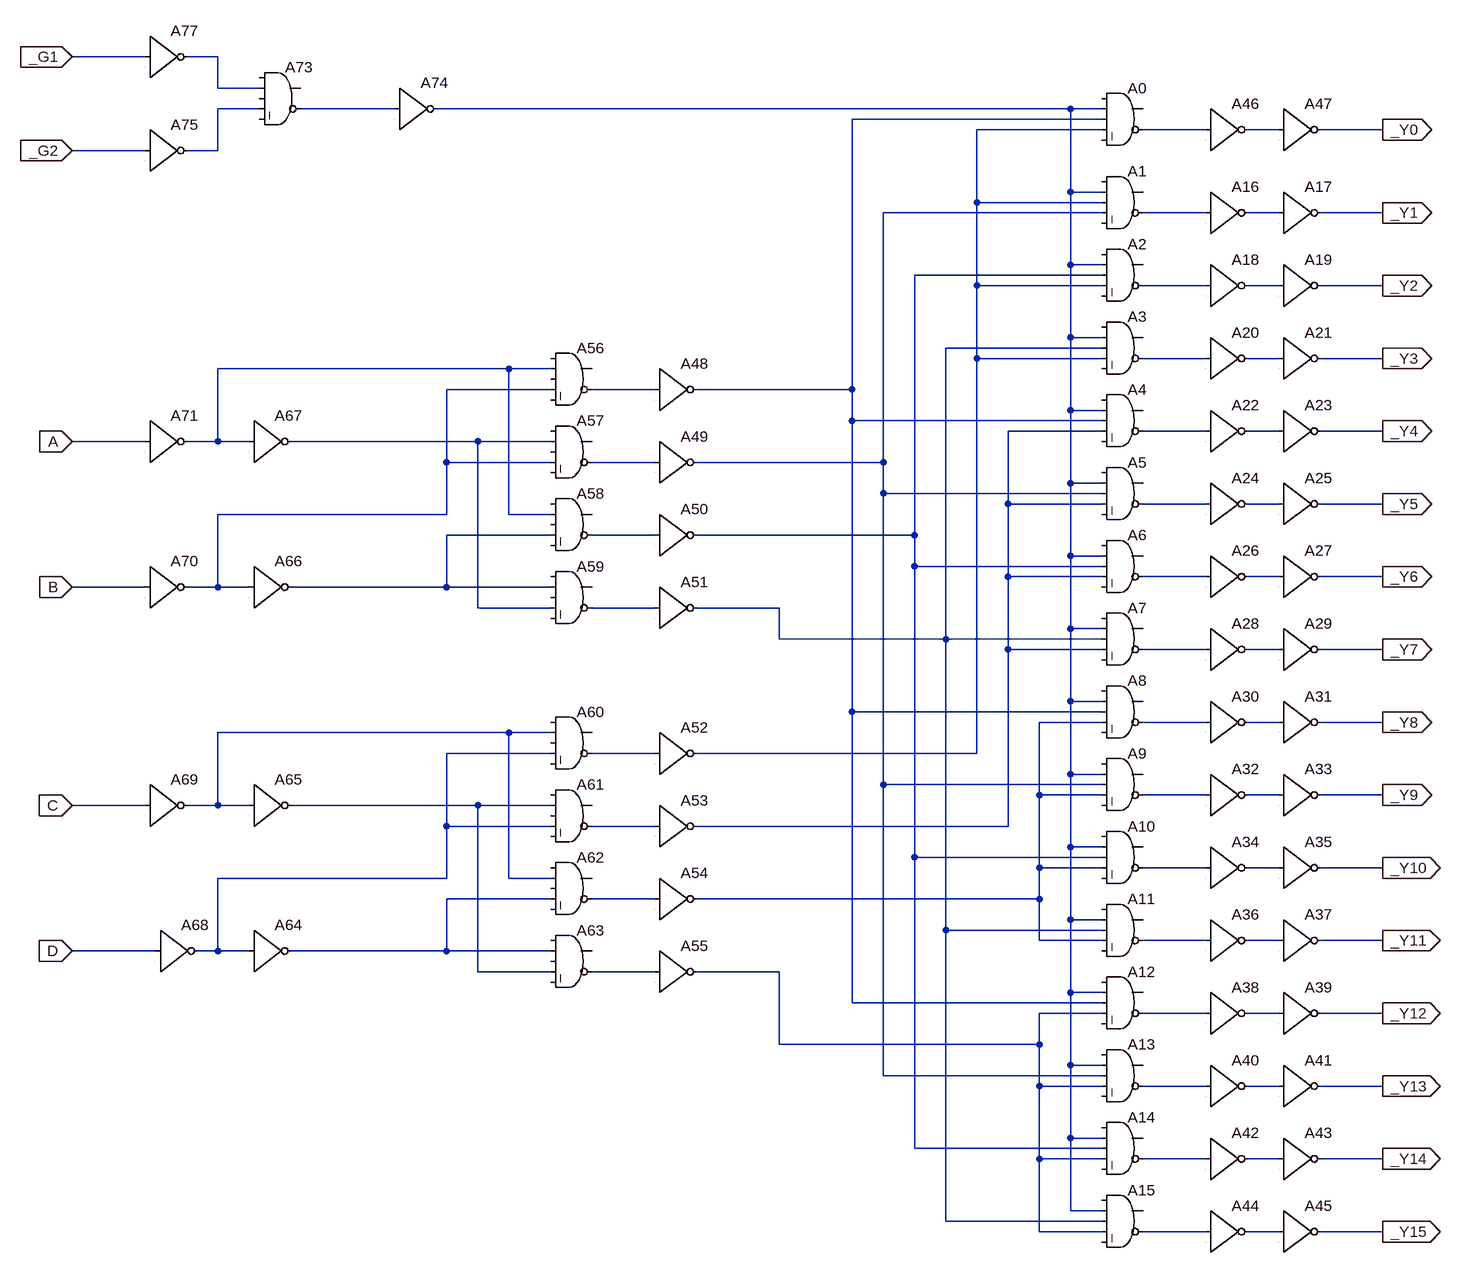
[diagram p0: schematic 74hc154.asc]
74hc154.asc, the LTspice schematic file:
Version 4
SHEET 1 880 1736
WIRE -1344 -144 -1456 -144
WIRE -1232 -144 -1280 -144
WIRE -1232 -96 -1232 -144
WIRE -1168 -96 -1232 -96
WIRE -1168 -64 -1232 -64
WIRE -960 -64 -1104 -64
WIRE 80 -64 -896 -64
WIRE 128 -64 80 -64
WIRE 128 -48 -256 -48
WIRE 128 -32 -64 -32
WIRE 288 -32 192 -32
WIRE 400 -32 352 -32
WIRE 560 -32 464 -32
WIRE -1344 0 -1456 0
WIRE -1232 0 -1232 -64
WIRE -1232 0 -1280 0
WIRE 80 64 80 -64
WIRE 128 64 80 64
WIRE -64 80 -64 -32
WIRE 128 80 -64 80
WIRE 128 96 -208 96
WIRE 288 96 192 96
WIRE 400 96 352 96
WIRE 560 96 464 96
WIRE 80 176 80 64
WIRE 128 176 80 176
WIRE 128 192 -160 192
WIRE -64 208 -64 80
WIRE 128 208 -64 208
WIRE 288 208 192 208
WIRE 400 208 352 208
WIRE 560 208 464 208
WIRE 80 288 80 176
WIRE 128 288 80 288
WIRE 128 304 -112 304
WIRE -64 320 -64 208
WIRE 128 320 -64 320
WIRE 288 320 192 320
WIRE 400 320 352 320
WIRE 560 320 464 320
WIRE -784 336 -1232 336
WIRE -720 336 -784 336
WIRE -720 368 -880 368
WIRE -560 368 -656 368
WIRE -256 368 -256 -48
WIRE -256 368 -496 368
WIRE 80 400 80 288
WIRE 128 400 80 400
WIRE -256 416 -256 368
WIRE 128 416 -256 416
WIRE 128 432 -16 432
WIRE 288 432 192 432
WIRE 400 432 352 432
WIRE 560 432 464 432
WIRE -1344 448 -1456 448
WIRE -1232 448 -1232 336
WIRE -1232 448 -1280 448
WIRE -1184 448 -1232 448
WIRE -832 448 -1120 448
WIRE -720 448 -832 448
WIRE -880 480 -880 368
WIRE -720 480 -880 480
WIRE -560 480 -656 480
WIRE -208 480 -208 96
WIRE -208 480 -496 480
WIRE 80 512 80 400
WIRE 128 512 80 512
WIRE -208 528 -208 480
WIRE 128 528 -208 528
WIRE -16 544 -16 432
WIRE 128 544 -16 544
WIRE 288 544 192 544
WIRE 400 544 352 544
WIRE 560 544 464 544
WIRE -880 560 -880 480
WIRE -880 560 -1232 560
WIRE -784 560 -784 336
WIRE -720 560 -784 560
WIRE -720 592 -880 592
WIRE -560 592 -656 592
WIRE -160 592 -160 192
WIRE -160 592 -496 592
WIRE 80 624 80 512
WIRE 128 624 80 624
WIRE -160 640 -160 592
WIRE 128 640 -160 640
WIRE -16 656 -16 544
WIRE 128 656 -16 656
WIRE 288 656 192 656
WIRE 400 656 352 656
WIRE 560 656 464 656
WIRE -1344 672 -1456 672
WIRE -1232 672 -1232 560
WIRE -1232 672 -1280 672
WIRE -1184 672 -1232 672
WIRE -880 672 -880 592
WIRE -880 672 -1120 672
WIRE -720 672 -880 672
WIRE -832 704 -832 448
WIRE -720 704 -832 704
WIRE -560 704 -656 704
WIRE -368 704 -496 704
WIRE 80 736 80 624
WIRE 128 736 80 736
WIRE -368 752 -368 704
WIRE -112 752 -112 304
WIRE -112 752 -368 752
WIRE 128 752 -112 752
WIRE -16 768 -16 656
WIRE 128 768 -16 768
WIRE 288 768 192 768
WIRE 400 768 352 768
WIRE 560 768 464 768
WIRE 80 848 80 736
WIRE 128 848 80 848
WIRE -256 864 -256 416
WIRE 128 864 -256 864
WIRE 128 880 32 880
WIRE 288 880 192 880
WIRE 400 880 352 880
WIRE 560 880 464 880
WIRE -784 896 -1232 896
WIRE -720 896 -784 896
WIRE -720 928 -880 928
WIRE -560 928 -656 928
WIRE -64 928 -64 320
WIRE -64 928 -496 928
WIRE 80 960 80 848
WIRE 128 960 80 960
WIRE -208 976 -208 528
WIRE 128 976 -208 976
WIRE 32 992 32 880
WIRE 128 992 32 992
WIRE 288 992 192 992
WIRE 400 992 352 992
WIRE 560 992 464 992
WIRE -1344 1008 -1456 1008
WIRE -1232 1008 -1232 896
WIRE -1232 1008 -1280 1008
WIRE -1184 1008 -1232 1008
WIRE -832 1008 -1120 1008
WIRE -720 1008 -832 1008
WIRE -880 1040 -880 928
WIRE -720 1040 -880 1040
WIRE -560 1040 -656 1040
WIRE -16 1040 -16 768
WIRE -16 1040 -496 1040
WIRE 80 1072 80 960
WIRE 128 1072 80 1072
WIRE -160 1088 -160 640
WIRE 128 1088 -160 1088
WIRE 32 1104 32 992
WIRE 128 1104 32 1104
WIRE 288 1104 192 1104
WIRE 400 1104 352 1104
WIRE 560 1104 464 1104
WIRE -880 1120 -880 1040
WIRE -880 1120 -1232 1120
WIRE -784 1120 -784 896
WIRE -720 1120 -784 1120
WIRE -720 1152 -880 1152
WIRE -560 1152 -656 1152
WIRE 32 1152 32 1104
WIRE 32 1152 -496 1152
WIRE 80 1184 80 1072
WIRE 128 1184 80 1184
WIRE -112 1200 -112 752
WIRE 128 1200 -112 1200
WIRE 32 1216 32 1152
WIRE 128 1216 32 1216
WIRE 288 1216 192 1216
WIRE 400 1216 352 1216
WIRE 560 1216 464 1216
WIRE -1328 1232 -1456 1232
WIRE -1232 1232 -1232 1120
WIRE -1232 1232 -1264 1232
WIRE -1184 1232 -1232 1232
WIRE -880 1232 -880 1152
WIRE -880 1232 -1120 1232
WIRE -720 1232 -880 1232
WIRE -832 1264 -832 1008
WIRE -720 1264 -832 1264
WIRE -560 1264 -656 1264
WIRE -368 1264 -496 1264
WIRE 80 1296 80 1184
WIRE 128 1296 80 1296
WIRE -256 1312 -256 864
WIRE 128 1312 -256 1312
WIRE 128 1328 32 1328
WIRE 288 1328 192 1328
WIRE 400 1328 352 1328
WIRE 560 1328 464 1328
WIRE -368 1376 -368 1264
WIRE 32 1376 32 1328
WIRE 32 1376 -368 1376
WIRE 80 1408 80 1296
WIRE 128 1408 80 1408
WIRE -208 1424 -208 976
WIRE 128 1424 -208 1424
WIRE 32 1440 32 1376
WIRE 128 1440 32 1440
WIRE 288 1440 192 1440
WIRE 400 1440 352 1440
WIRE 560 1440 464 1440
WIRE 80 1520 80 1408
WIRE 128 1520 80 1520
WIRE -160 1536 -160 1088
WIRE 128 1536 -160 1536
WIRE 32 1552 32 1440
WIRE 128 1552 32 1552
WIRE 288 1552 192 1552
WIRE 400 1552 352 1552
WIRE 560 1552 464 1552
WIRE 80 1632 80 1520
WIRE 128 1632 80 1632
WIRE -112 1648 -112 1200
WIRE 128 1648 -112 1648
WIRE 32 1664 32 1552
WIRE 128 1664 32 1664
WIRE 288 1664 192 1664
WIRE 400 1664 352 1664
WIRE 560 1664 464 1664
FLAG 560 96 _Y1
IOPIN 560 96 Out
FLAG 560 208 _Y2
IOPIN 560 208 Out
FLAG 560 320 _Y3
IOPIN 560 320 Out
FLAG 560 432 _Y4
IOPIN 560 432 Out
FLAG 560 544 _Y5
IOPIN 560 544 Out
FLAG 560 656 _Y6
IOPIN 560 656 Out
FLAG 560 768 _Y7
IOPIN 560 768 Out
FLAG 560 880 _Y8
IOPIN 560 880 Out
FLAG 560 992 _Y9
IOPIN 560 992 Out
FLAG 560 1104 _Y10
IOPIN 560 1104 Out
FLAG 560 1216 _Y11
IOPIN 560 1216 Out
FLAG 560 1328 _Y12
IOPIN 560 1328 Out
FLAG 560 1440 _Y13
IOPIN 560 1440 Out
FLAG 560 1552 _Y14
IOPIN 560 1552 Out
FLAG 560 1664 _Y15
IOPIN 560 1664 Out
FLAG 560 -32 _Y0
IOPIN 560 -32 Out
FLAG -1456 -144 _G1
IOPIN -1456 -144 In
FLAG -1456 0 _G2
IOPIN -1456 0 In
FLAG -1456 448 A
IOPIN -1456 448 In
FLAG -1456 672 B
IOPIN -1456 672 In
FLAG -1456 1008 C
IOPIN -1456 1008 In
FLAG -1456 1232 D
IOPIN -1456 1232 In
SYMBOL Digital\\and 160 16 R0
SYMATTR InstName A1
SYMBOL Digital\\and 160 128 R0
SYMATTR InstName A2
SYMBOL Digital\\and 160 240 R0
SYMATTR InstName A3
SYMBOL Digital\\and 160 352 R0
SYMATTR InstName A4
SYMBOL Digital\\and 160 464 R0
SYMATTR InstName A5
SYMBOL Digital\\and 160 576 R0
SYMATTR InstName A6
SYMBOL Digital\\and 160 688 R0
SYMATTR InstName A7
SYMBOL Digital\\and 160 800 R0
SYMATTR InstName A8
SYMBOL Digital\\and 160 912 R0
SYMATTR InstName A9
SYMBOL Digital\\and 160 1024 R0
SYMATTR InstName A10
SYMBOL Digital\\and 160 1136 R0
SYMATTR InstName A11
SYMBOL Digital\\and 160 1248 R0
SYMATTR InstName A12
SYMBOL Digital\\and 160 1360 R0
SYMATTR InstName A13
SYMBOL Digital\\and 160 1472 R0
SYMATTR InstName A14
SYMBOL Digital\\and 160 1584 R0
SYMATTR InstName A15
SYMBOL Digital\\inv 288 32 R0
SYMATTR InstName A16
SYMBOL Digital\\inv 400 32 R0
SYMATTR InstName A17
SYMBOL Digital\\inv 288 144 R0
SYMATTR InstName A18
SYMBOL Digital\\inv 400 144 R0
SYMATTR InstName A19
SYMBOL Digital\\inv 288 256 R0
SYMATTR InstName A20
SYMBOL Digital\\inv 400 256 R0
SYMATTR InstName A21
SYMBOL Digital\\inv 288 368 R0
SYMATTR InstName A22
SYMBOL Digital\\inv 400 368 R0
SYMATTR InstName A23
SYMBOL Digital\\inv 288 480 R0
SYMATTR InstName A24
SYMBOL Digital\\inv 400 480 R0
SYMATTR InstName A25
SYMBOL Digital\\inv 288 592 R0
SYMATTR InstName A26
SYMBOL Digital\\inv 400 592 R0
SYMATTR InstName A27
SYMBOL Digital\\inv 288 704 R0
SYMATTR InstName A28
SYMBOL Digital\\inv 400 704 R0
SYMATTR InstName A29
SYMBOL Digital\\inv 288 816 R0
SYMATTR InstName A30
SYMBOL Digital\\inv 400 816 R0
SYMATTR InstName A31
SYMBOL Digital\\inv 288 928 R0
SYMATTR InstName A32
SYMBOL Digital\\inv 400 928 R0
SYMATTR InstName A33
SYMBOL Digital\\inv 288 1040 R0
SYMATTR InstName A34
SYMBOL Digital\\inv 400 1040 R0
SYMATTR InstName A35
SYMBOL Digital\\inv 288 1152 R0
SYMATTR InstName A36
SYMBOL Digital\\inv 400 1152 R0
SYMATTR InstName A37
SYMBOL Digital\\inv 288 1264 R0
SYMATTR InstName A38
SYMBOL Digital\\inv 400 1264 R0
SYMATTR InstName A39
SYMBOL Digital\\inv 288 1376 R0
SYMATTR InstName A40
SYMBOL Digital\\inv 400 1376 R0
SYMATTR InstName A41
SYMBOL Digital\\inv 288 1488 R0
SYMATTR InstName A42
SYMBOL Digital\\inv 400 1488 R0
SYMATTR InstName A43
SYMBOL Digital\\inv 288 1600 R0
SYMATTR InstName A44
SYMBOL Digital\\inv 400 1600 R0
SYMATTR InstName A45
SYMBOL Digital\\inv 288 -96 R0
SYMATTR InstName A46
SYMBOL Digital\\inv 400 -96 R0
SYMATTR InstName A47
SYMBOL Digital\\and 160 -112 R0
SYMATTR InstName A0
SYMBOL Digital\\inv -560 304 R0
SYMATTR InstName A48
SYMBOL Digital\\inv -560 416 R0
SYMATTR InstName A49
SYMBOL Digital\\inv -560 528 R0
SYMATTR InstName A50
SYMBOL Digital\\inv -560 640 R0
SYMATTR InstName A51
SYMBOL Digital\\inv -560 864 R0
SYMATTR InstName A52
SYMBOL Digital\\inv -560 976 R0
SYMATTR InstName A53
SYMBOL Digital\\inv -560 1088 R0
SYMATTR InstName A54
SYMBOL Digital\\inv -560 1200 R0
SYMATTR InstName A55
SYMBOL Digital\\and -688 288 R0
SYMATTR InstName A56
SYMBOL Digital\\and -688 400 R0
SYMATTR InstName A57
SYMBOL Digital\\and -688 512 R0
SYMATTR InstName A58
SYMBOL Digital\\and -688 624 R0
SYMATTR InstName A59
SYMBOL Digital\\and -688 848 R0
SYMATTR InstName A60
SYMBOL Digital\\and -688 960 R0
SYMATTR InstName A61
SYMBOL Digital\\and -688 1072 R0
SYMATTR InstName A62
SYMBOL Digital\\and -688 1184 R0
SYMATTR InstName A63
SYMBOL Digital\\inv -1184 1168 R0
SYMATTR InstName A64
SYMBOL Digital\\inv -1184 944 R0
SYMATTR InstName A65
SYMBOL Digital\\inv -1184 608 R0
SYMATTR InstName A66
SYMBOL Digital\\inv -1184 384 R0
SYMATTR InstName A67
SYMBOL Digital\\inv -1328 1168 R0
SYMATTR InstName A68
SYMBOL Digital\\inv -1344 944 R0
SYMATTR InstName A69
SYMBOL Digital\\inv -1344 608 R0
SYMATTR InstName A70
SYMBOL Digital\\inv -1344 384 R0
SYMATTR InstName A71
SYMBOL Digital\\inv -960 -128 R0
SYMATTR InstName A74
SYMBOL Digital\\inv -1344 -64 R0
SYMATTR InstName A75
SYMBOL Digital\\inv -1344 -208 R0
SYMATTR InstName A77
SYMBOL Digital\\and -1136 -144 R0
SYMATTR InstName A73

The netlist it stands for:
* 74hc154.asc
A1 0 N004 N006 N009 0 N010 0 0 AND
A2 0 N004 N012 N006 0 N013 0 0 AND
A3 0 N004 N015 N006 0 N016 0 0 AND
A4 0 N004 N005 N021 0 N022 0 0 AND
A5 0 N004 N009 N021 0 N026 0 0 AND
A6 0 N004 N012 N021 0 N030 0 0 AND
A7 0 N004 N015 N021 0 N033 0 0 AND
A8 0 N004 N005 N035 0 N036 0 0 AND
A9 0 N004 N009 N035 0 N041 0 0 AND
A10 0 N004 N012 N035 0 N045 0 0 AND
A11 0 N004 N015 N035 0 N049 0 0 AND
A12 0 N004 N005 N052 0 N053 0 0 AND
A13 0 N004 N009 N052 0 N055 0 0 AND
A14 0 N004 N012 N052 0 N057 0 0 AND
A15 0 N004 N015 N052 0 N059 0 0 AND
A16 N010 0 0 0 0 N011 0 0 BUF
A17 N011 0 0 0 0 _Y1 0 0 BUF
A18 N013 0 0 0 0 N014 0 0 BUF
A19 N014 0 0 0 0 _Y2 0 0 BUF
A20 N016 0 0 0 0 N017 0 0 BUF
A21 N017 0 0 0 0 _Y3 0 0 BUF
A22 N022 0 0 0 0 N023 0 0 BUF
A23 N023 0 0 0 0 _Y4 0 0 BUF
A24 N026 0 0 0 0 N027 0 0 BUF
A25 N027 0 0 0 0 _Y5 0 0 BUF
A26 N030 0 0 0 0 N031 0 0 BUF
A27 N031 0 0 0 0 _Y6 0 0 BUF
A28 N033 0 0 0 0 N034 0 0 BUF
A29 N034 0 0 0 0 _Y7 0 0 BUF
A30 N036 0 0 0 0 N037 0 0 BUF
A31 N037 0 0 0 0 _Y8 0 0 BUF
A32 N041 0 0 0 0 N042 0 0 BUF
A33 N042 0 0 0 0 _Y9 0 0 BUF
A34 N045 0 0 0 0 N046 0 0 BUF
A35 N046 0 0 0 0 _Y10 0 0 BUF
A36 N049 0 0 0 0 N050 0 0 BUF
A37 N050 0 0 0 0 _Y11 0 0 BUF
A38 N053 0 0 0 0 N054 0 0 BUF
A39 N054 0 0 0 0 _Y12 0 0 BUF
A40 N055 0 0 0 0 N056 0 0 BUF
A41 N056 0 0 0 0 _Y13 0 0 BUF
A42 N057 0 0 0 0 N058 0 0 BUF
A43 N058 0 0 0 0 _Y14 0 0 BUF
A44 N059 0 0 0 0 N060 0 0 BUF
A45 N060 0 0 0 0 _Y15 0 0 BUF
A46 N007 0 0 0 0 N008 0 0 BUF
A47 N008 0 0 0 0 _Y0 0 0 BUF
A0 0 N004 N005 N006 0 N007 0 0 AND
A48 N020 0 0 0 0 N005 0 0 BUF
A49 N025 0 0 0 0 N009 0 0 BUF
A50 N029 0 0 0 0 N012 0 0 BUF
A51 N032 0 0 0 0 N015 0 0 BUF
A52 N040 0 0 0 0 N006 0 0 BUF
A53 N044 0 0 0 0 N021 0 0 BUF
A54 N048 0 0 0 0 N035 0 0 BUF
A55 N051 0 0 0 0 N052 0 0 BUF
A56 0 N018 0 N019 0 N020 0 0 AND
A57 0 N024 0 N019 0 N025 0 0 AND
A58 0 N018 0 N028 0 N029 0 0 AND
A59 0 N028 0 N024 0 N032 0 0 AND
A60 0 N038 0 N039 0 N040 0 0 AND
A61 0 N043 0 N039 0 N044 0 0 AND
A62 0 N038 0 N047 0 N048 0 0 AND
A63 0 N047 0 N043 0 N051 0 0 AND
A64 N039 0 0 0 0 N047 0 0 BUF
A65 N038 0 0 0 0 N043 0 0 BUF
A66 N019 0 0 0 0 N028 0 0 BUF
A67 N018 0 0 0 0 N024 0 0 BUF
A68 D 0 0 0 0 N039 0 0 BUF
A69 C 0 0 0 0 N038 0 0 BUF
A70 B 0 0 0 0 N019 0 0 BUF
A71 A 0 0 0 0 N018 0 0 BUF
A74 N003 0 0 0 0 N004 0 0 BUF
A75 _G2 0 0 0 0 N002 0 0 BUF
A77 _G1 0 0 0 0 N001 0 0 BUF
A73 0 N001 0 N002 0 N003 0 0 AND
.backanno
.end